# Altium project HEAT.PrjPcb
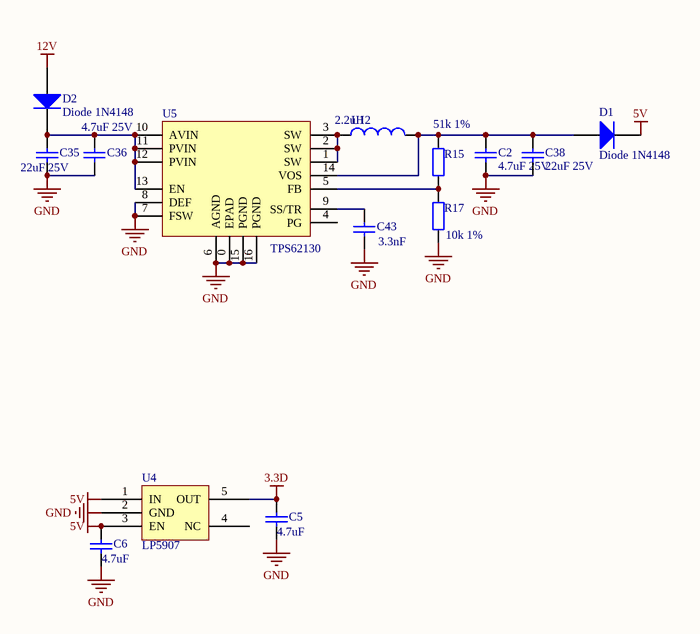
[diagram p0: power.SchDoc]
3 sheets, 126 parts. Net scope: flat (ports and power ports of the same name join across sheets).
Board file: HEAT.PcbDoc
Sheets:
  power.SchDoc
  HEAT.SchDoc
  MCU.SchDoc

## Sheet power.SchDoc
size A4

### Parts
C2  value 4.7uF 25V  [0603]  (hidden comment: Cap)
C5  4.7uF  [0603L]
C6  4.7uF  [0603L]
C35  value 22uF 25V  [0805]  (hidden comment: Cap)
C36  value 4.7uF 25V  [0603]  (hidden comment: Cap)
C38  value 22uF 25V  [0805]  (hidden comment: Cap)
C43  3.3nF  [0402]
D1  Diode 1N4148  [LC-SOD-323]
D2  Diode 1N4148  [LC-SOD-323]
L12  2.2uH  [L4015]
R15  51k 1%  [0402]
R17  10k 1%  [0402]
U4  LP5907  [SOT23-5]
U5  TPS62130  [TPS62130]

### Nets
3.3D: C5.2 U4.5(OUT)
5V: C6.2 D1.2(K) U4.1(IN) U4.3(EN)
12V: D2.1(A)
GND: C2.1 C5.1 C6.1 C35.2 C36.2 C38.1 C43.2 R17.2 U4.2(GND) U5.0(EPAD) U5.6(AGND) U5.7(FSW) U5.8(DEF) U5.15(PGND) U5.16(PGND)
NetC2_2: C2.2 C38.2 D1.1(A) L12.2 R15.1 U5.14(VOS)
NetC35_1: C35.1 C36.1 D2.2(K) U5.10(AVIN) U5.11(PVIN) U5.12(PVIN) U5.13(EN)
NetC43_1: C43.1 U5.9(SS/TR)
NetL12_1: L12.1 U5.1(SW) U5.2(SW) U5.3(SW)
NetR15_2: R15.2 R17.1 U5.5(FB)

Not connected (* = marked no-connect by the designer): U4 4(NC); U5 4(PG)

### Library data of the parts
C2 C5 C6 C35 C36 C38 C43 = Cap: Capacitor; Published: 8-Jun-2000; LatestRevisionDate: 17-Jul-2002; LatestRevisionNote: Re-released for DXP Platform.; PackageReference: RAD-0.3; Publisher: Altium Limited; PackageDescription: Radial Cap, Thru-Hole; 2 Leads; 0.3 in Pin Spacing
D1 D2 = Diode 1N4148: High Conductance Fast Diode; Published: 8-Jun-2000; LatestRevisionDate: 17-Jul-2002; LatestRevisionNote: Re-released for DXP Platform.; DatasheetVersion: 1997; PackageReference: DO-35; Publisher: Altium Limited; PackageDescription: Diode, Axial; Body 3.8 x 1.9 mm (LxDia. max), Lead Dia. 0.53 mm (max); Code_JEDEC: DO-204-AH; ComponentLink1Description: Manufacturer Link; ComponentLink1URL: http://www.fairchildsemi.com/; ComponentLink2Description: Datasheet; ComponentLink2URL: http://www.fairchildsemi.com/ds/1N%2F1N4148.pdf
L12 = Inductor: Code_IEC: 1005; Published: 8-Jun-2000; LatestRevisionDate: 29-May-2009; LatestRevisionNote: IPC-7351 Footprint Added.; PackageReference: 0402-A; Publisher: Altium Limited; PackageDescription: Chip Inductor; Code_JEITA: 0402
R15 R17 = Res2: Resistor; Published: 8-Jun-2000; LatestRevisionDate: 17-Jul-2002; LatestRevisionNote: Re-released for DXP Platform.; PackageReference: AXIAL-0.4; Publisher: Altium Limited; PackageDescription: Axial Device, Thru-Hole; 2 Leads; 0.4 in Pin Spacing

## Sheet HEAT.SchDoc
size A4
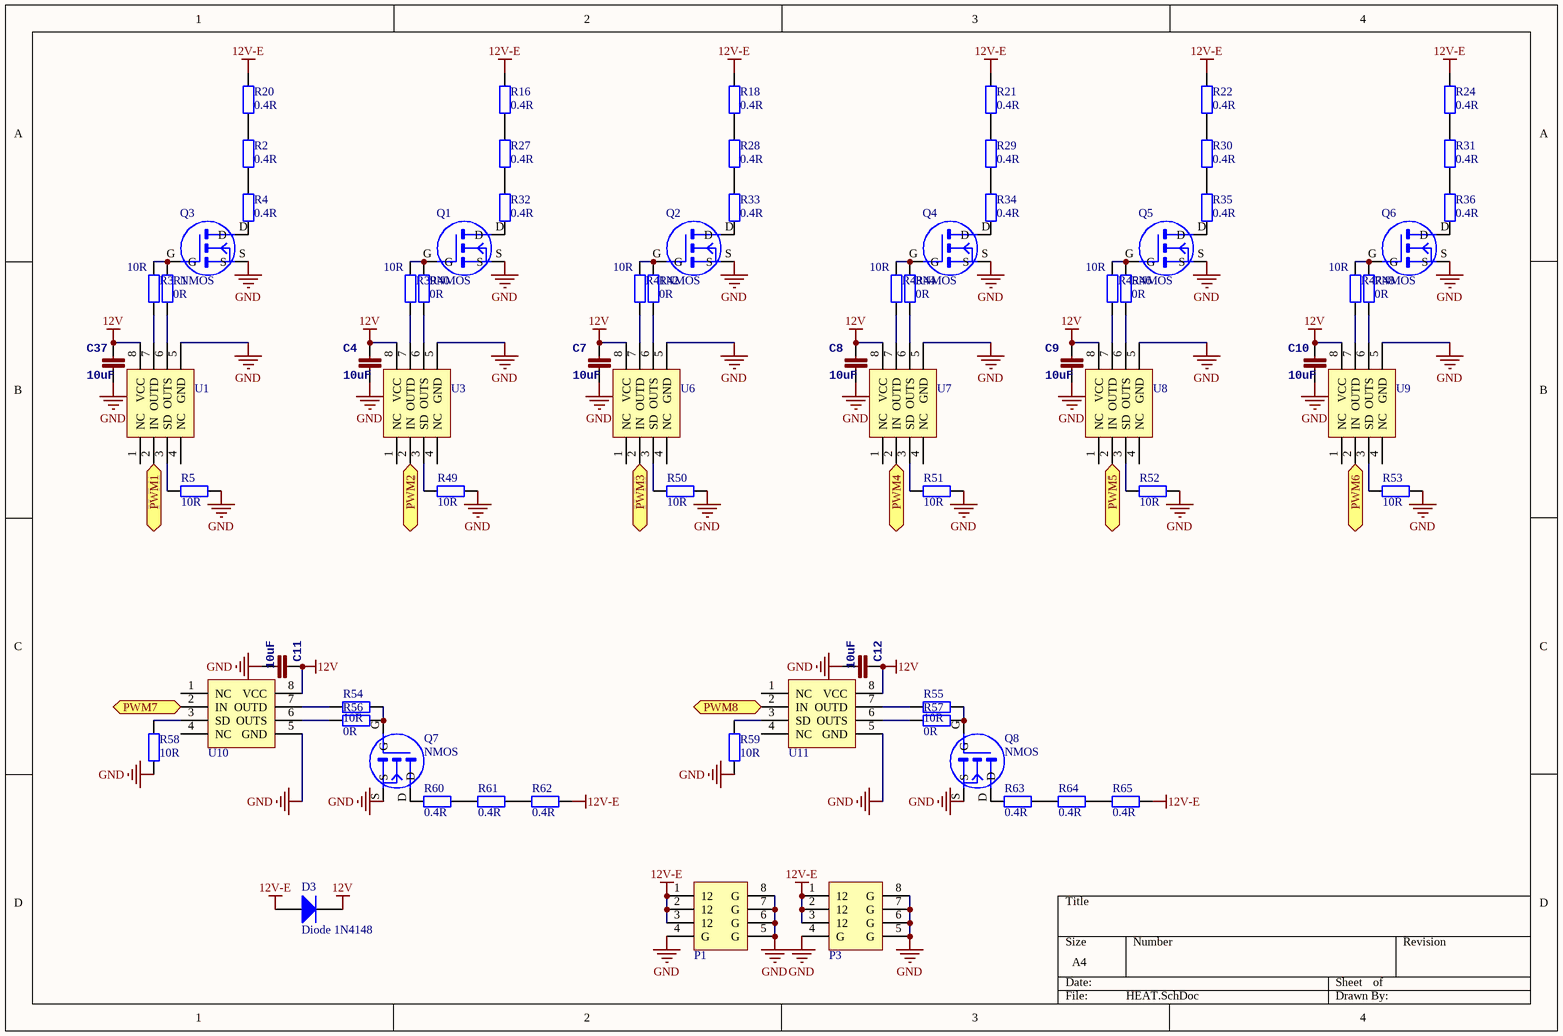
[diagram p1: HEAT.SchDoc]

### Parts
C4  10uF  [0805]
C7  10uF  [0805]
C8  10uF  [0805]
C9  10uF  [0805]
C10  10uF  [0805]
C11  10uF  [0805]
C12  10uF  [0805]
C37  10uF  [0805]
D3  Diode 1N4148  [LC-SOD-323]
P1  PCIE-8P  [PCIE_8PIN]  (value not drawn)
P3  PCIE-8P  [PCIE_8PIN]  (value not drawn)
Q1  NMOS  [BSC025N03MS]
Q2  NMOS  [BSC025N03MS]
Q3  NMOS  [BSC025N03MS]
Q4  NMOS  [BSC025N03MS]
Q5  NMOS  [BSC025N03MS]
Q6  NMOS  [BSC025N03MS]
Q7  NMOS  [BSC025N03MS]
Q8  NMOS  [BSC025N03MS]
R1  0R  [0402]
R2  0.4R  [2512]
R3  10R  [0402]
R4  0.4R  [2512]
R5  10R  [0402]
R16  0.4R  [2512]
R18  0.4R  [2512]
R20  0.4R  [2512]
R21  0.4R  [2512]
R22  0.4R  [2512]
R24  0.4R  [2512]
R27  0.4R  [2512]
R28  0.4R  [2512]
R29  0.4R  [2512]
R30  0.4R  [2512]
R31  0.4R  [2512]
R32  0.4R  [2512]
R33  0.4R  [2512]
R34  0.4R  [2512]
R35  0.4R  [2512]
R36  0.4R  [2512]
R39  10R  [0402]
R40  0R  [0402]
R41  10R  [0402]
R42  0R  [0402]
R43  10R  [0402]
R44  0R  [0402]
R45  10R  [0402]
R46  0R  [0402]
R47  10R  [0402]
R48  0R  [0402]
R49  10R  [0402]
R50  10R  [0402]
R51  10R  [0402]
R52  10R  [0402]
R53  10R  [0402]
R54  10R  [0402]
R55  10R  [0402]
R56  0R  [0402]
R57  0R  [0402]
R58  10R  [0402]
R59  10R  [0402]
R60  0.4R  [2512]
R61  0.4R  [2512]
R62  0.4R  [2512]
R63  0.4R  [2512]
R64  0.4R  [2512]
R65  0.4R  [2512]
U1  EG2131  [SO8]  (value not drawn)
U3  EG2131  [SO8]  (value not drawn)
U6  EG2131  [SO8]  (value not drawn)
U7  EG2131  [SO8]  (value not drawn)
U8  EG2131  [SO8]  (value not drawn)
U9  EG2131  [SO8]  (value not drawn)
U10  EG2131  [SO8]  (value not drawn)
U11  EG2131  [SO8]  (value not drawn)

### Ports
PWM1, PWM2, PWM3, PWM4, PWM5, PWM6, PWM7, PWM8

### Nets
12V: C4.2 C7.2 C8.2 C9.2 C10.2 C11.2 C12.2 C37.2 D3.2(K) U1.8(VCC) U3.8(VCC) U6.8(VCC) U7.8(VCC) U8.8(VCC) U9.8(VCC) U10.8(VCC) U11.8(VCC)
12V-E: D3.1(A) P1.1(12) P1.2(12) P1.3(12) P3.1(12) P3.2(12) P3.3(12) R16.1 R18.1 R20.1 R21.1 R22.1 R24.1 R62.1 R65.1
GND: C4.1 C7.1 C8.1 C9.1 C10.1 C11.1 C12.1 C37.1 P1.4(G) P1.5(G) P1.6(G) P1.7(G) P1.8(G) P3.4(G) P3.5(G) P3.6(G) P3.7(G) P3.8(G) Q1.S Q2.S Q3.S Q4.S Q5.S Q6.S Q7.S Q8.S R5.2 R49.2 R50.2 R51.2 R52.2 R53.2 R58.2 R59.2 U1.5(GND) U3.5(GND) U6.5(GND) U7.5(GND) U8.5(GND) U9.5(GND) U10.5(GND) U11.5(GND)
NetLED1_1: U3.2(IN) ; port PWM2
NetLED2_1: U6.2(IN) ; port PWM3
NetLED3_1: U1.2(IN) ; port PWM1
NetLED4_1: U7.2(IN) ; port PWM4
NetLED5_1: U8.2(IN) ; port PWM5
NetLED6_1: U9.2(IN) ; port PWM6
NetLED7_1: U10.2(IN) ; port PWM7
NetLED8_1: U11.2(IN) ; port PWM8
NetQ1_D: Q1.D R32.2
NetQ1_G: Q1.G R39.1 R40.1
NetQ2_D: Q2.D R33.2
NetQ2_G: Q2.G R41.1 R42.1
NetQ3_D: Q3.D R4.2
NetQ3_G: Q3.G R1.1 R3.1
NetQ4_D: Q4.D R34.2
NetQ4_G: Q4.G R43.1 R44.1
NetQ5_D: Q5.D R35.2
NetQ5_G: Q5.G R45.1 R46.1
NetQ6_D: Q6.D R36.2
NetQ6_G: Q6.G R47.1 R48.1
NetQ7_D: Q7.D R60.2
NetQ7_G: Q7.G R54.1 R56.1
NetQ8_D: Q8.D R63.2
NetQ8_G: Q8.G R55.1 R57.1
NetR1_2: R1.2 U1.6(OUTS)
NetR2_1: R2.1 R20.2
NetR2_2: R2.2 R4.1
NetR3_2: R3.2 U1.7(OUTD)
NetR5_1: R5.1 U1.3(SD)
NetR16_2: R16.2 R27.1
NetR18_2: R18.2 R28.1
NetR21_2: R21.2 R29.1
NetR22_2: R22.2 R30.1
NetR24_2: R24.2 R31.1
NetR27_2: R27.2 R32.1
NetR28_2: R28.2 R33.1
NetR29_2: R29.2 R34.1
NetR30_2: R30.2 R35.1
NetR31_2: R31.2 R36.1
NetR39_2: R39.2 U3.7(OUTD)
NetR40_2: R40.2 U3.6(OUTS)
NetR41_2: R41.2 U6.7(OUTD)
NetR42_2: R42.2 U6.6(OUTS)
NetR43_2: R43.2 U7.7(OUTD)
NetR44_2: R44.2 U7.6(OUTS)
NetR45_2: R45.2 U8.7(OUTD)
NetR46_2: R46.2 U8.6(OUTS)
NetR47_2: R47.2 U9.7(OUTD)
NetR48_2: R48.2 U9.6(OUTS)
NetR49_1: R49.1 U3.3(SD)
NetR50_1: R50.1 U6.3(SD)
NetR51_1: R51.1 U7.3(SD)
NetR52_1: R52.1 U8.3(SD)
NetR53_1: R53.1 U9.3(SD)
NetR54_2: R54.2 U10.7(OUTD)
NetR55_2: R55.2 U11.7(OUTD)
NetR56_2: R56.2 U10.6(OUTS)
NetR57_2: R57.2 U11.6(OUTS)
NetR58_1: R58.1 U10.3(SD)
NetR59_1: R59.1 U11.3(SD)
NetR60_1: R60.1 R61.2
NetR61_1: R61.1 R62.2
NetR63_1: R63.1 R64.2
NetR64_1: R64.1 R65.2

Not connected (* = marked no-connect by the designer): U1 1(NC) 4(NC); U3 1(NC) 4(NC); U6 1(NC) 4(NC); U7 1(NC) 4(NC); U8 1(NC) 4(NC); U9 1(NC) 4(NC); U10 1(NC) 4(NC); U11 1(NC) 4(NC)

### Library data of the parts
C4 C7-C12 C37 = CAP0402-CAP: <b>Capacitor</b> / Standard 0603 ceramic capacitor, and 0.1" leaded capacitor.; PARTNO: CC0402ZRY5V7BB104
D3 = Diode 1N4148: High Conductance Fast Diode; Published: 8-Jun-2000; LatestRevisionDate: 17-Jul-2002; LatestRevisionNote: Re-released for DXP Platform.; DatasheetVersion: 1997; PackageReference: DO-35; Publisher: Altium Limited; PackageDescription: Diode, Axial; Body 3.8 x 1.9 mm (LxDia. max), Lead Dia. 0.53 mm (max); Code_JEDEC: DO-204-AH; ComponentLink1Description: Manufacturer Link; ComponentLink1URL: http://www.fairchildsemi.com/; ComponentLink2Description: Datasheet; ComponentLink2URL: http://www.fairchildsemi.com/ds/1N%2F1N4148.pdf
R1 R3 R5 R39-R59 = Res2: Resistor; Value: 0Ohm; Published: 8-Jun-2000; LatestRevisionDate: 17-Jul-2002; LatestRevisionNote: Re-released for DXP Platform.; PackageReference: AXIAL-0.4; Publisher: Altium Limited; PackageDescription: Axial Device, Thru-Hole; 2 Leads; 0.4 in Pin Spacing
R2 R4 R16 R18 R20-R22 R24 R27-R36 R60-R65 = Res2: 电阻; Value: 0Ohm; Published: 8-Jun-2000; LatestRevisionDate: 17-Jul-2002; LatestRevisionNote: Re-released for DXP Platform.; PackageReference: AXIAL-0.4; Publisher: Altium Limited; PackageDescription: Axial Device, Thru-Hole; 2 Leads; 0.4 in Pin Spacing

## Sheet MCU.SchDoc
size A4
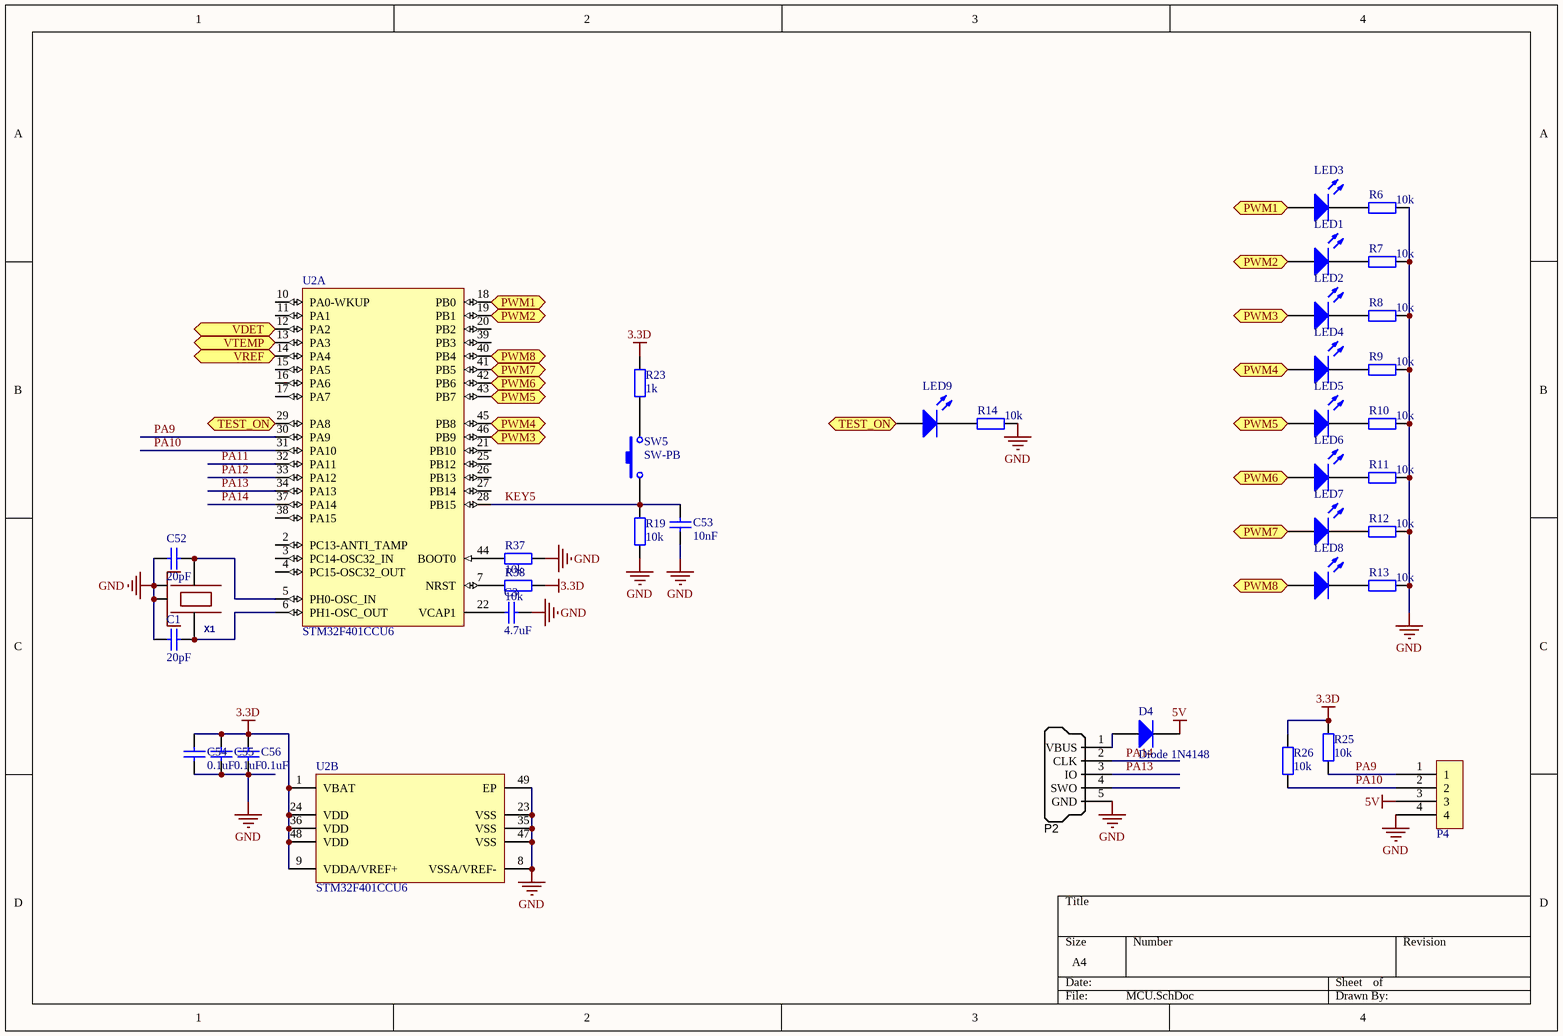
[diagram p2: MCU.SchDoc]

### Parts
C1  value 20pF  [0402]  (hidden comment: Cap)
C3  value 4.7uF  [0603]  (hidden comment: Cap)
C52  value 20pF  [0402]  (hidden comment: Cap)
C53  value 10nF  [0402]  (hidden comment: Cap)
C54  value 0.1uF  [0402]  (hidden comment: Cap)
C55  value 0.1uF  [0402]  (hidden comment: Cap)
C56  value 0.1uF  [0402]  (hidden comment: Cap)
D4  Diode 1N4148  [LC-SOD-323]
LED1  (no value)  [0603]
LED2  (no value)  [0603]
LED3  (no value)  [0603]
LED4  (no value)  [0603]
LED5  (no value)  [0603]
LED6  (no value)  [0603]
LED7  (no value)  [0603]
LED8  (no value)  [0603]
LED9  (no value)  [0603]
P2  SWD_MicroUSB  [MICRO-YZX]  (value not drawn)
P4  UART/I2C  [4P]  (value not drawn)
R6  10k  [0402]
R7  10k  [0402]
R8  10k  [0402]
R9  10k  [0402]
R10  10k  [0402]
R11  10k  [0402]
R12  10k  [0402]
R13  10k  [0402]
R14  10k  [0402]
R19  10k  [0402]
R23  1k  [0402]
R25  10k  [0402]
R26  10k  [0402]
R37  value 10k  [0402]  (hidden comment: Res2)
R38  value 10k  [0402]  (hidden comment: Res2)
SW5  SW-PB  [SW3x4]
U2  STM32F401CCU6  [STM-UFQFPN48_N]  (parts A,B of 2)
X1  24.000 KHz 3.2x2.5mm 8-10pf  [OSCILLATOR-3.2X2.5]  (value not drawn)

### Ports
PWM1, PWM2, PWM3, PWM4, PWM5, PWM6, PWM7, PWM8, TEST_ON, VDET, VREF, VTEMP

### Nets
3.3D: C54.2 C55.2 C56.2 R23.2 R25.2 R26.2 R38.1 U2.1(VBAT) U2.9(VDDA/VREF+) U2.24(VDD) U2.36(VDD) U2.48(VDD)
5V: D4.2(K) P4.3
GND: C1.1 C3.1 C52.1 C53.1 C54.1 C55.1 C56.1 P2.5(GND) P4.4 R6.2 R7.2 R8.2 R9.2 R10.2 R11.2 R12.2 R13.2 R14.2 R19.1 R37.2 U2.8(VSSA/VREF-) U2.23(VSS) U2.35(VSS) U2.47(VSS) U2.49(EP) X1.2(NC_2) X1.4(NC_4)
KEY5: C53.2 R19.2 SW5.1 U2.28(PB15)
PA9: P4.1 R25.1 U2.30(PA9)
PA10: P4.2 R26.1 U2.31(PA10)
PA11: U2.32(PA11)
PA12: U2.33(PA12)
PA13: P2.3(IO) U2.34(PA13)
PA14: P2.2(CLK) U2.37(PA14)
NetC1_2: C1.2 U2.6(PH1-OSC_OUT) X1.3
NetC3_2: C3.2 U2.22(VCAP1)
NetC52_2: C52.2 U2.5(PH0-OSC_IN) X1.1
NetD4_1: D4.1(A) P2.1(VBUS)
NetLED1_1: LED1.1(A) U2.19(PB1) ; port PWM2
NetLED1_2: LED1.2(K) R7.1
NetLED2_1: LED2.1(A) U2.46(PB9) ; port PWM3
NetLED2_2: LED2.2(K) R8.1
NetLED3_1: LED3.1(A) U2.18(PB0) ; port PWM1
NetLED3_2: LED3.2(K) R6.1
NetLED4_1: LED4.1(A) U2.45(PB8) ; port PWM4
NetLED4_2: LED4.2(K) R9.1
NetLED5_1: LED5.1(A) U2.43(PB7) ; port PWM5
NetLED5_2: LED5.2(K) R10.1
NetLED6_1: LED6.1(A) U2.42(PB6) ; port PWM6
NetLED6_2: LED6.2(K) R11.1
NetLED7_1: LED7.1(A) U2.41(PB5) ; port PWM7
NetLED7_2: LED7.2(K) R12.1
NetLED8_1: LED8.1(A) U2.40(PB4) ; port PWM8
NetLED8_2: LED8.2(K) R13.1
NetLED9_1: LED9.1(A) U2.29(PA8) ; port TEST_ON
NetLED9_2: LED9.2(K) R14.1
NetR23_1: R23.1 SW5.2
NetR37_1: R37.1 U2.44(BOOT0)
NetR38_2: R38.2 U2.7(NRST)
NetU2_12: U2.12(PA2) ; port VDET
NetU2_13: U2.13(PA3) ; port VTEMP
NetU2_14: U2.14(PA4) ; port VREF

Not connected (* = marked no-connect by the designer): P2 4(SWO); U2 2(PC13-ANTI_TAMP) 3(PC14-OSC32_IN) 4(PC15-OSC32_OUT) 10(PA0-WKUP) 11(PA1) 15(PA5) 16(PA6) 17(PA7) 20(PB2) 21(PB10) 25(PB12) 26(PB13) 27(PB14) 38(PA15) 39(PB3)

### Library data of the parts
C1 C3 C52-C56 = Cap: Capacitor; Published: 8-Jun-2000; LatestRevisionDate: 17-Jul-2002; LatestRevisionNote: Re-released for DXP Platform.; PackageReference: RAD-0.3; Publisher: Altium Limited; PackageDescription: Radial Cap, Thru-Hole; 2 Leads; 0.3 in Pin Spacing
D4 = Diode 1N4148: High Conductance Fast Diode; Published: 8-Jun-2000; LatestRevisionDate: 17-Jul-2002; LatestRevisionNote: Re-released for DXP Platform.; DatasheetVersion: 1997; PackageReference: DO-35; Publisher: Altium Limited; PackageDescription: Diode, Axial; Body 3.8 x 1.9 mm (LxDia. max), Lead Dia. 0.53 mm (max); Code_JEDEC: DO-204-AH; ComponentLink1Description: Manufacturer Link; ComponentLink1URL: http://www.fairchildsemi.com/; ComponentLink2Description: Datasheet; ComponentLink2URL: http://www.fairchildsemi.com/ds/1N%2F1N4148.pdf
LED1-LED9 = LED0: Typical INFRARED GaAs LED; Published: 8-Jun-2000; LatestRevisionDate: 08-Jul-2005; LatestRevisionNote: Mech Layer 1 removed.; PackageReference: LED-0; Publisher: Altium Limited; PackageDescription: LED; 2 Leads
P2 = SWD_MicroUSB: Connector SMD USB Micro Type B middle mount; Manufacturer 1: Molex Inc; SCDType: undef; Package / Case: SMD; Supplier 1: Digi-Key; Supplier Part Number 1: WM17142CT-ND
P4 = 4PSocket
R6-R14 R19 R23 R25 R26 = Res2: Resistor; Value: 0Ohm; Published: 8-Jun-2000; LatestRevisionDate: 17-Jul-2002; LatestRevisionNote: Re-released for DXP Platform.; PackageReference: AXIAL-0.4; Publisher: Altium Limited; PackageDescription: Axial Device, Thru-Hole; 2 Leads; 0.4 in Pin Spacing
R37 R38 = Res2: Resistor; Published: 8-Jun-2000; LatestRevisionDate: 17-Jul-2002; LatestRevisionNote: Re-released for DXP Platform.; PackageReference: AXIAL-0.4; Publisher: Altium Limited; PackageDescription: Axial Device, Thru-Hole; 2 Leads; 0.4 in Pin Spacing
SW5 = SW-PB: Switch; Published: 24-Mar-1999; LatestRevisionDate: 17-Jul-2002; LatestRevisionNote: Re-released for DXP Platform.; PackageReference: SPST-2; Publisher: Altium Limited; PackageDescription: Switch; 2 Leads
U2 = STM32F401CCU6: ARM Cortex-M4 32-bit MCU+FPU, 105 DMIPS, 256 kB Flash, 64 kB Internal RAM, 36 I/Os, 48-pin UFQFPN, -40 to 85 degC, Tray; Manufacturer: STMicroelectronics; FLASH Size (Prog) (kB): 256; I/Os (High Current): 36; Internal RAM Size (kB): 64; Operating Frequency(F) (Processor speed) (MHz): 84; Supply Voltage(Vcc) max (V): 3.6; Supply Voltage(Vcc) min (V): 1.8; DatasheetVersion: Rev. 1; PackageVersion: Rev. 1, 04/2013; PackageReference: UFQFPN48; PackageDescription: 48-Pin Ultra Thin Fine Pitch Quad Flat No-Lead, 7 x 7 x 0.6 mm Body, 0.5 mm Pitch, Exposed Pad; Supplier 1: Newark; Supplier Part Number 1: 19X6217; Supplier 2: Mouser; Supplier Part Number 2: 511-STM32F401CCU6; Core: ARM Cortex-M4; Packing: Tray; Mounting Technology: Surface Mount; PartNumber: STM32F401CCU6; ComponentLink1Description: Manufacturer URL; ComponentLink1URL: http://www.st.com/web/en/home.html; ComponentLink2Description: Datasheet; ComponentLink2URL: http://www.st.com/st-web-ui/static/active/en/resource/technical/document/data_brief/DM00071938.pdf; ComponentLink3Description: Package Specification; ComponentLink3URL: http://www.st.com/st-web-ui/static/active/en/resource/technical/document/data_brief/DM00071938.pdf
X1 = OSCILLATOR-3.2X2.5: Crystal Oscillator in 3.2x2.5 SMD

## Nets that join several sheets
3.3D: power (C5.2 U4.5), MCU (12 pins)
5V: power (C6.2 D1.2 U4.1 U4.3), MCU (D4.2 P4.3)
12V: power (D2.1), HEAT (17 pins)
GND: power (15 pins), HEAT (42 pins), MCU (27 pins)
NetLED1_1: HEAT (U3.2), MCU (LED1.1 U2.19)
NetLED2_1: HEAT (U6.2), MCU (LED2.1 U2.46)
NetLED3_1: HEAT (U1.2), MCU (LED3.1 U2.18)
NetLED4_1: HEAT (U7.2), MCU (LED4.1 U2.45)
NetLED5_1: HEAT (U8.2), MCU (LED5.1 U2.43)
NetLED6_1: HEAT (U9.2), MCU (LED6.1 U2.42)
NetLED7_1: HEAT (U10.2), MCU (LED7.1 U2.41)
NetLED8_1: HEAT (U11.2), MCU (LED8.1 U2.40)